# EAGLE design wifi_r3-esp_wr02 (EAGLE 7.4.0)
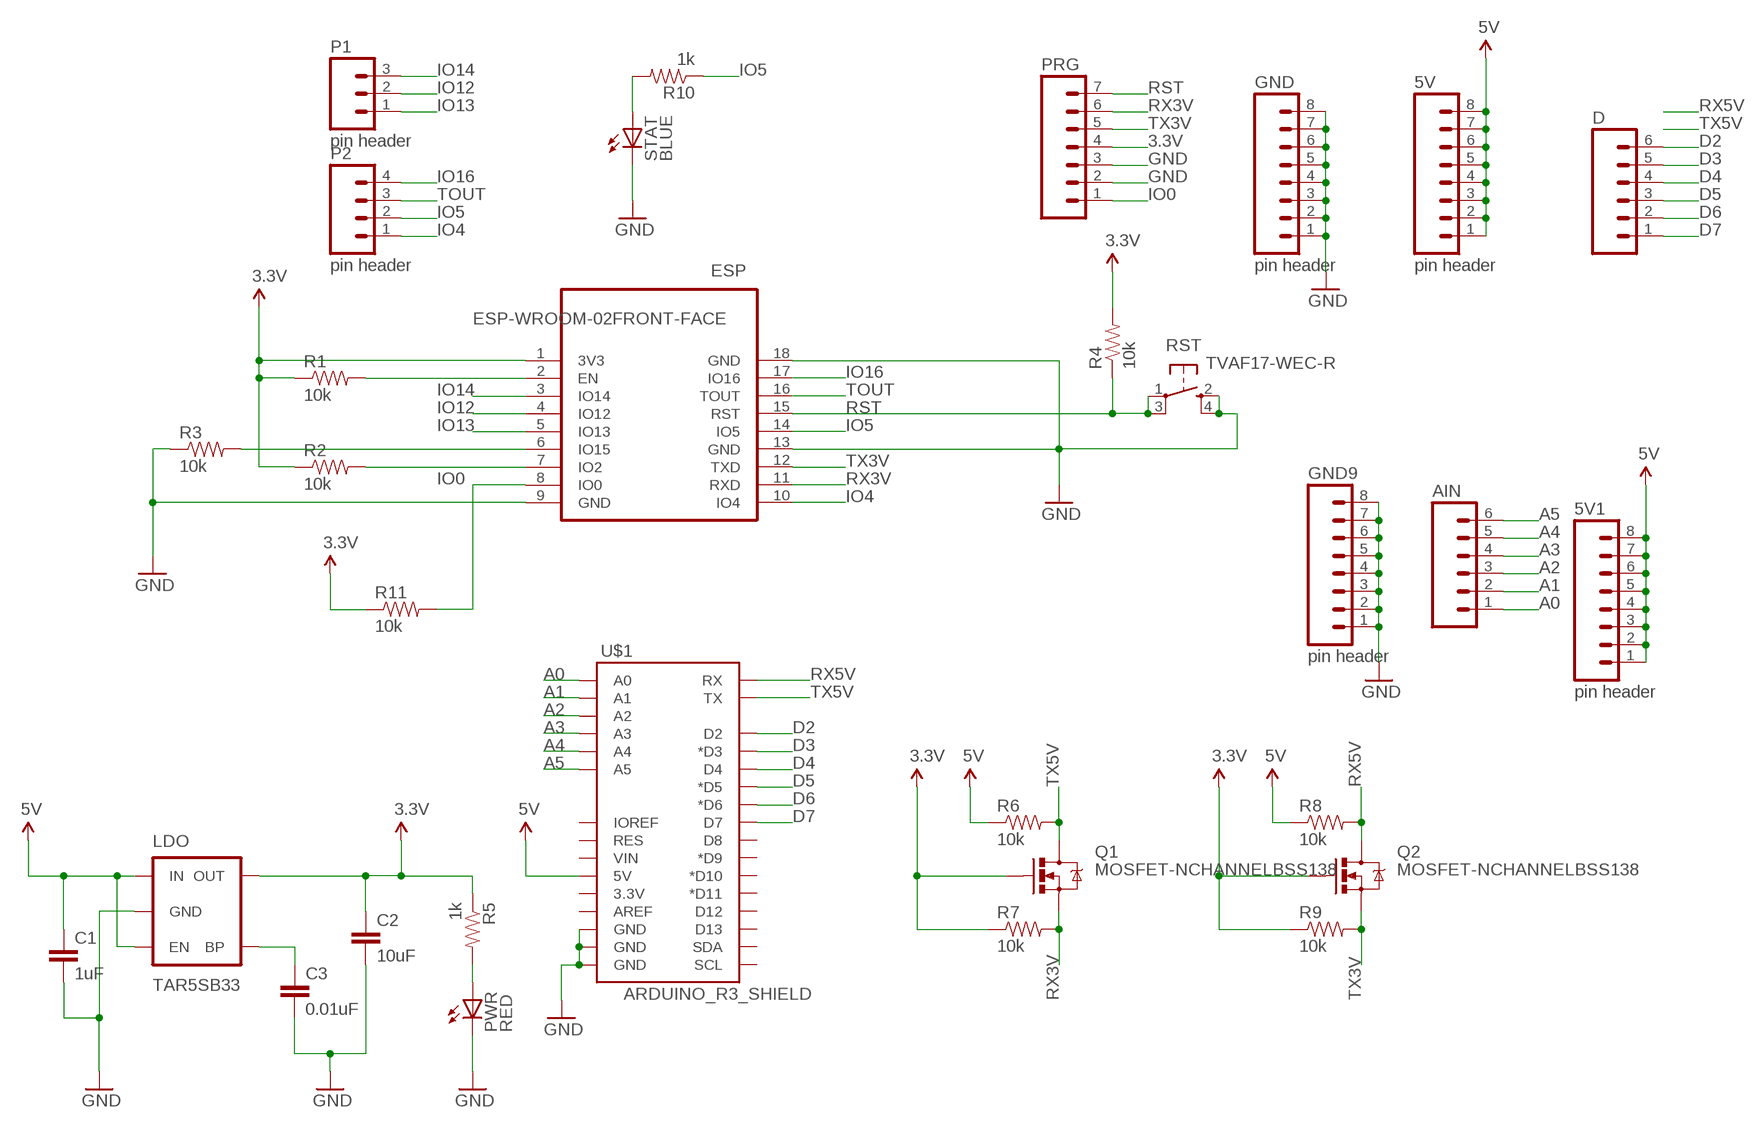
[diagram p0: schematic, sheet 1]

## Parts
5V  pin header  M081X08  [1X08]
5V1  pin header  M081X08  [1X08]
AIN  M06SIP  [1X06]
C1  1uF  CAP0603-CAP  [0603-CAP]
C2  10uF  CAP0805  [0805]
C3  0.01uF  CAP0603-CAP  [0603-CAP]
D  M06SIP  [1X06]
ESP  ESP-WROOM-02FRONT-FACE  [FRONT-FACE]
GND  pin header  M081X08  [1X08]
GND9  pin header  M081X08  [1X08]
LDO  TAR5SB33  [SOT23-5]
P1  pin header  M03PTH  [1X03]
P2  pin header  M04PTH  [1X04]
PRG  M07  [1X07]
PWR  RED  LED0603  [LED-0603]
Q1  MOSFET-NCHANNELBSS138  [SOT23]
Q2  MOSFET-NCHANNELBSS138  [SOT23]
R1  10k  RESISTOR0603  [0603-RES]
R2  10k  RESISTOR0603  [0603-RES]
R3  10k  RESISTOR0603  [0603-RES]
R4  10k  RESISTOR0603  [0603-RES]
R5  1k  RESISTOR0603  [0603-RES]
R6  10k  RESISTOR0603  [0603-RES]
R7  10k  RESISTOR0603  [0603-RES]
R8  10k  RESISTOR0603  [0603-RES]
R9  10k  RESISTOR0603  [0603-RES]
R10  1k  RESISTOR0603  [0603-RES]
R11  10k  RESISTOR0603  [0603-RES]
RST  TVAF17-WEC-R  SPST_TACT-KMR2  [KMR2]
STAT  BLUE  LED0603  [LED-0603]
U$1  ARDUINO_R3_SHIELD  [UNO_R3_SHIELD]

## Nets
3.3V: C2.1 ESP.1(3V3) LDO.5(OUT) PRG.4 Q1.1(G) Q2.1(G) R1.1 R2.1 R4.2 R5.1 R7.1 R9.1 R11.1
5V: 5V1.1 5V1.2 5V1.3 5V1.4 5V1.5 5V1.6 5V1.7 5V1.8 5V.1 5V.2 5V.3 5V.4 5V.5 5V.6 5V.7 5V.8 C1.1 LDO.1(IN) LDO.3(EN) R6.1 R8.1 U$1.5V
A0: AIN.1 U$1.A0
A1: AIN.2 U$1.A1
A2: AIN.3 U$1.A2
A3: AIN.4 U$1.A3
A4: AIN.5 U$1.A4
A5: AIN.6 U$1.A5
D2: D.6 U$1.D2
D3: D.5 U$1.D3(*D3)
D4: D.4 U$1.D4
D5: D.3 U$1.D5(*D5)
D6: D.2 U$1.D6(*D6)
D7: D.1 U$1.D7
GND: C1.2 C2.2 C3.2 ESP.9(GND) ESP.13(GND) ESP.18(GND) GND9.1 GND9.2 GND9.3 GND9.4 GND9.5 GND9.6 GND9.7 GND9.8 GND.1 GND.2 GND.3 GND.4 GND.5 GND.6 GND.7 GND.8 LDO.2(GND) PRG.2 PRG.3 PWR.C R3.1 RST.2(S) RST.4(S) STAT.C U$1.GND@0(GND) U$1.GND@1(GND) U$1.GND@2(GND)
IO0: ESP.8(IO0) PRG.1 R11.2
IO4: ESP.10(IO4) P2.1
IO5: ESP.14(IO5) P2.2 R10.1
IO12: ESP.4(IO12) P1.2
IO13: ESP.5(IO13) P1.1
IO14: ESP.3(IO14) P1.3
IO16: ESP.17(IO16) P2.4
N$3: ESP.2(EN) R1.2
N$4: ESP.7(IO2) R2.2
N$5: ESP.6(IO15) R3.2
N$118: PWR.A R5.2
N$119: R10.2 STAT.A
N$121: C3.1 LDO.4(BP)
RST: ESP.15(RST) PRG.7 R4.1 RST.1(P) RST.3(P)
RX3V: ESP.11(RXD) PRG.6 Q1.2(S) R7.2
RX5V: Q2.3(D) R8.2 U$1.RX
TOUT: ESP.16(TOUT) P2.3
TX3V: ESP.12(TXD) PRG.5 Q2.2(S) R9.2
TX5V: Q1.3(D) R6.2 U$1.TX
Unconnected: U$1.3.3V U$1.AREF U$1.D8 U$1.D9(*D9) U$1.D10(*D10) U$1.D11(*D11) U$1.D12 U$1.D13 U$1.IOREF U$1.RES U$1.SCL U$1.SDA U$1.VIN

## Library data of the parts
5V 5V1 GND GND9 = SparkFun-Connectors:M08: Header 8 Standard 8-pin 0.1" header. Use with straight break away headers (SKU : PRT-00116), right angle break away headers (PRT-00553), swiss pins (PRT-00743), machine pins (PRT-00117), and female headers (PRT-00115).
AIN D = SparkFun-Connectors:M06: Header 6 Standard 6-pin 0.1" header. Use with straight break away headers (SKU : PRT-00116), right angle break away headers (PRT-00553), swiss pins (PRT-00743), machine pins (PRT-00117), and female headers (PRT-00115). Molex polarized connector foot print use with SKU : PRT-08094 with associated crimp pins and housings. NOTES ON THE VARIANTS LOCK and LOCK_LONGPADS... This footprint was designed to help hold the alignment of a through-hole component (i.e. 6-pin header) while soldering it into place. You may notice that each hole has been shifted either up or down by 0.005 of an inch from it's more standard position (which is a perfectly straight line). This slight alteration caused the pins (the squares in the middle) to touch the edges of the holes. Because they are alternating, it causes a "brace" to hold the component in place. 0.005 has proven to be the perfect amount of "off-center" position when using our standard breakaway headers. Although looks a little odd when you look at the bare footprint, once you have a header in there, the alteration is very hard to notice. Also,if you push a header all the way into place, it is covered up entirely on the bottom side. This idea of altering the position of holes to aid alignment will be further integrated into the Sparkfun Library for other footprints. It can help hold any component with 3 or more connection pins.
C1-C3 = SparkFun-Capacitors:CAP: Capacitor Standard 0603 ceramic capacitor, and 0.1" leaded capacitor.
ESP = esp-wroom-02:ESP-WROOM-02: WiFi module - ESP-WROOM-02
LDO = y_PowerIC:TAR5SB: TAR5SB LDO Regulator TAR5SB15 - TAR5SB50 Vin 15V Iout 200mA ceramic condensor usable PIN FUNCTION 1. VIN 2. GND 3. CONTROL (Active High) 4. NOISE BYPASS 5. VOUT; PROD_ID: VREG-00822
P1 = SparkFun-Connectors:M03: Header 3 Standard 3-pin 0.1" header. Use with straight break away headers (SKU : PRT-00116), right angle break away headers (PRT-00553), swiss pins (PRT-00743), machine pins (PRT-00117), and female headers (PRT-00115). Molex polarized connector foot print use with SKU : PRT-08232 with associated crimp pins and housings.
P2 = SparkFun-Connectors:M04: Header 4 Standard 4-pin 0.1" header. Use with straight break away headers (SKU : PRT-00116), right angle break away headers (PRT-00553), swiss pins (PRT-00743), machine pins (PRT-00117), and female headers (PRT-00115). Molex polarized connector foot print use with SKU : PRT-08231 with associated crimp pins and housings. 1MM SMD Version SKU: PRT-10208
PRG = SparkFun-Connectors:M07: Header 7 Standard 7-pin 0.1" header. Use with straight break away headers (SKU : PRT-00116), right angle break away headers (PRT-00553), swiss pins (PRT-00743), machine pins (PRT-00117), and female headers (PRT-00115). NOTES ON THE VARIANTS LOCK and LOCK_LONGPADS... This footprint was designed to help hold the alignment of a through-hole component (i.e. 7-pin header) while soldering it into place. You may notice that each hole has been shifted either up or down by 0.005 of an inch from it's more standard position (which is usually a perfectly straight line). This slight alteration caused the pins (the squares in the middle) to touch the edges of the holes. Because they are alternating, it causes a "brace" to hold the header in place. 0.005 has proven to be the perfect amount of "off-center" position when using our standard breakaway headers. Although looks a little odd when you look at the bare footprint, once you have a header in there, the alteration is very hard to notice. Also, if you push a header all the way into place, it is covered up entirely on the bottom side. This idea of altering the position of holes to aid alignment will be further integrated into the Sparkfun Library for other footprints. It can help hold any component with 3 or more connection pins.
PWR STAT = SparkFun-LED:LED: LEDs Standard schematic elements and footprints for 5mm, 3mm, 1206, and 0603 sized LEDs. 5mm - Spark Fun Electronics SKU : COM-00529 (and others)
Q1 Q2 = SparkFun-DiscreteSemi:MOSFET-NCHANNEL: Common NMOSFET Parts MFG P/N Store ID Prod ID FDD8780 TRANS-09984 SI7820DN TRANS-11055 FDS6630A IC-08089 2N7002PW TRANS-11151 FQP30N06L COM-10213 TRANS-10060 BSS123LT1G TRANS-08345 BSS138 TRANS-00830 BS170 2N7000; PROD_ID: TRANS-00830
R1-R11 = SparkFun-Resistors:RESISTOR: Resistor Basic schematic elements and footprints for 0603, 1206, and PTH resistors.
RST = y_switch:SPST_TACT: SMT 6mm switch, EVQQ2 series http://www.ladyada.net/library/eagle
U$1 = SparkFun-Boards:ARDUINO_R3_SHIELD: Shield form compatible with the Arduino Uno R3.

## Net classes
0 default: width 0.406 mm

## Board
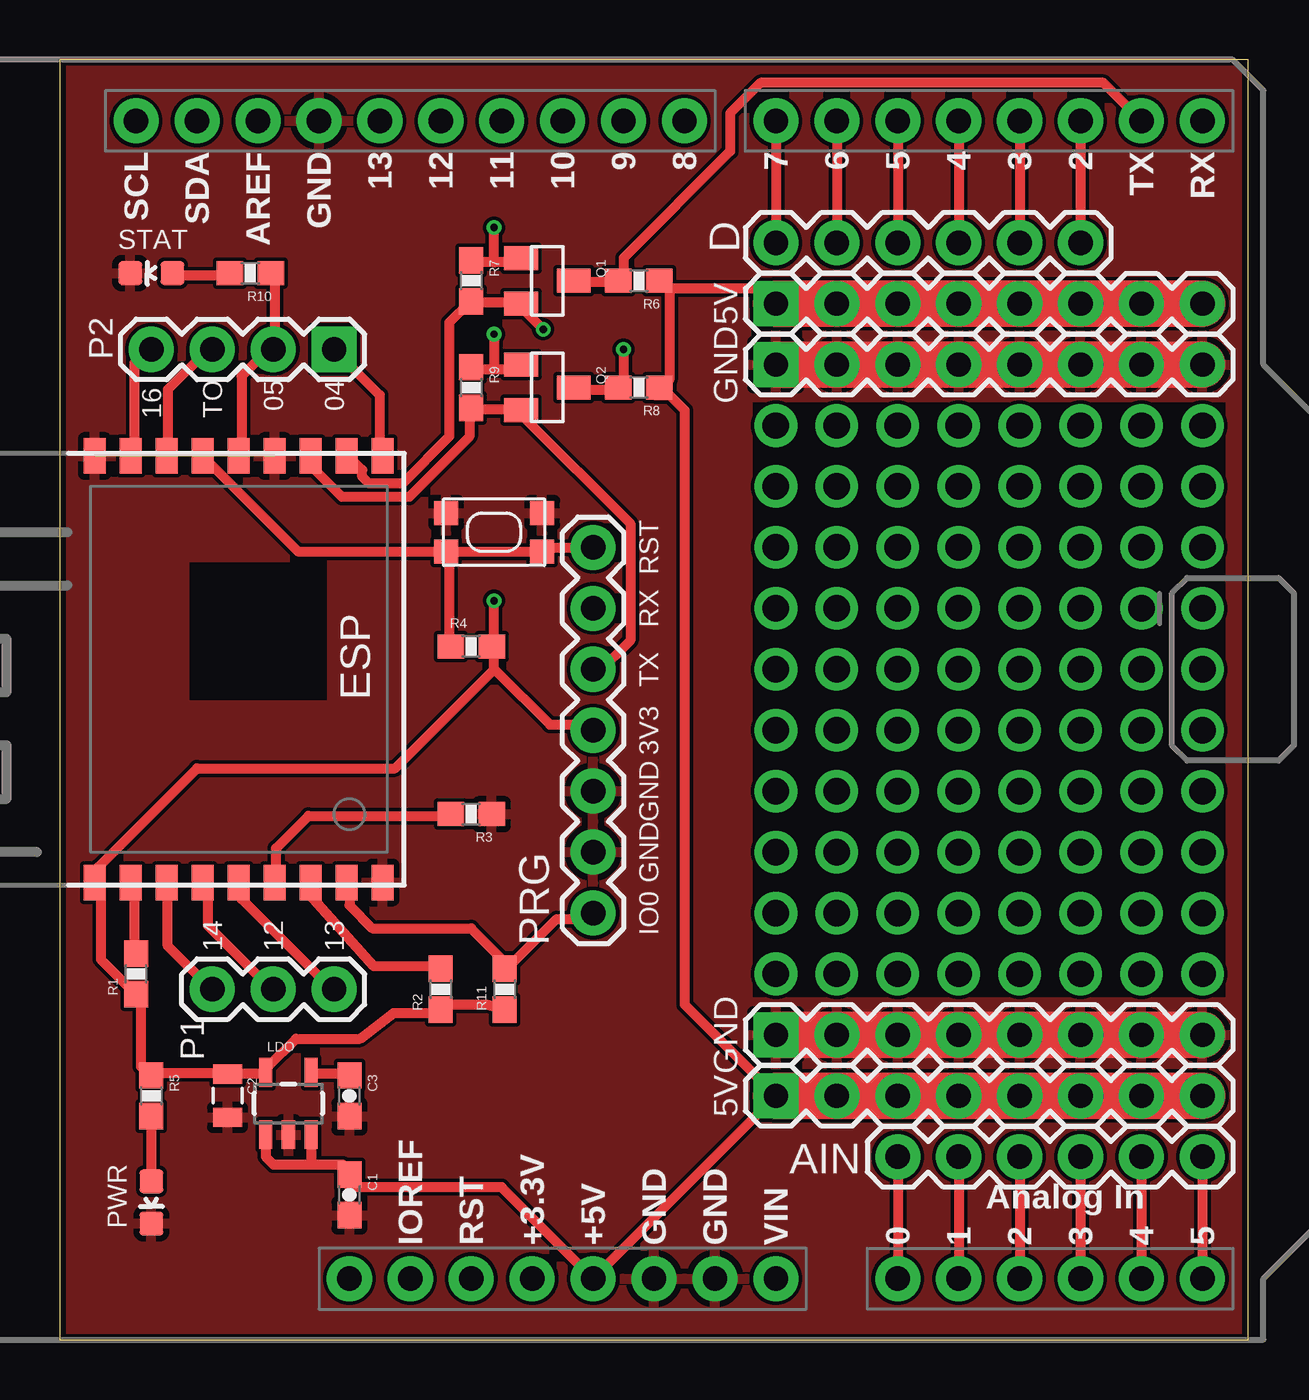
[diagram p1: board, top side]
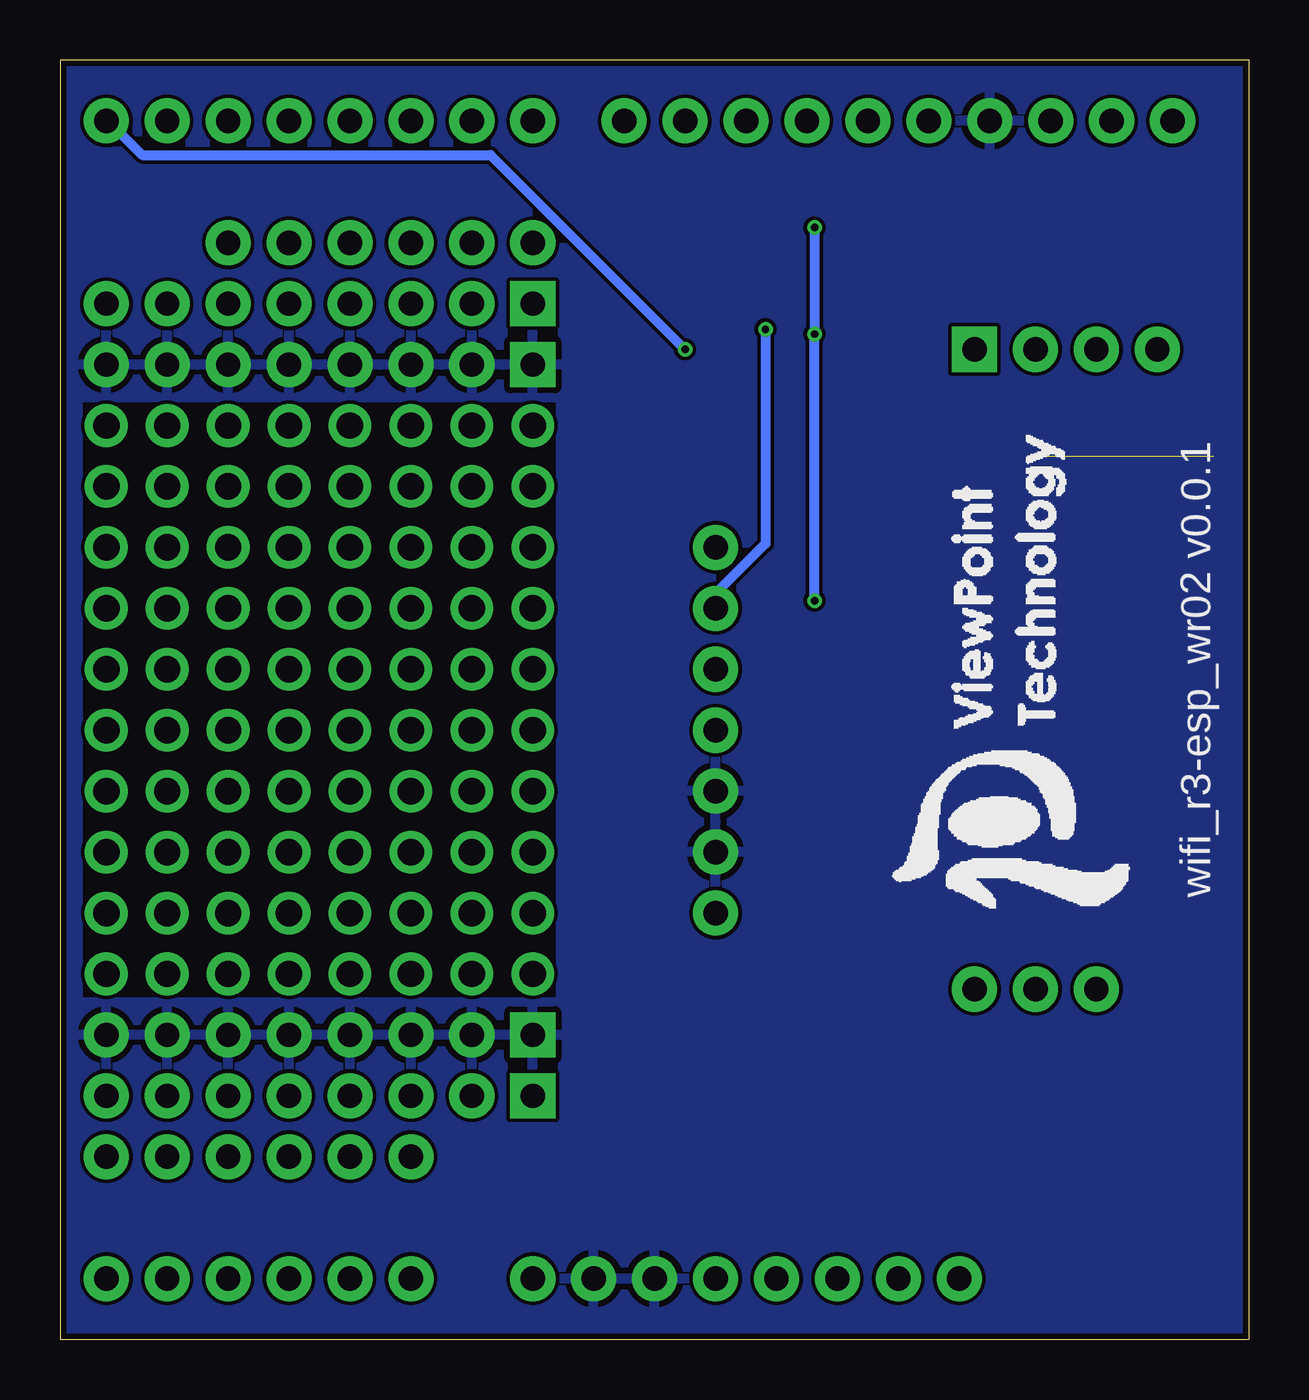
[diagram p2: board, bottom side, seen from below]

Size 49.53 x 53.34 mm. Coordinates in mm from the lower left corner, seen from the top.
Outline: 0,53.34 0,0 49.53,0 49.53,53.34 0,53.34
Copper layers (1*16): Top 0.035mm / dielectric 1.5mm / Bottom 0.035mm
Design rules "SeeedStudio_2layer_DRU_no_angle_20140221a": minimum track width 6mil, minimum drill 12mil, track to track 6mil, track to pad 6mil, pad to pad 6mil, via to via 6mil, smd to smd 0mil, copper to edge 10mil, drill to drill 10mil, minimum pad ring 10mil, minimum via ring 6mil, stop-mask expansion 2mil, vias tented up to drill 25mil, thermal gap 10mil
tRestrict: area 28.9,14.3 to 48.6,39.1
bRestrict: area 28.9,14.3 to 48.6,39.1

### Footprints (pad centres in the part's own frame; a part is rotated, then mirrored left to right if it is on the bottom)
1X08 = drill 1.016 pad 1.88 square: 1 0,0 | drill 1.016 pad 1.88: 2 2.54,0; 3 5.08,0; 4 7.62,0; 5 10.16,0; 6 12.7,0; 7 15.24,0; 8 17.78,0
1X06 = drill 1.016 pad 1.88: 1 0,0; 2 2.54,0; 3 5.08,0; 4 7.62,0; 5 10.16,0; 6 12.7,0
0603-CAP = smd 1.1 x 1: 1 -0.85,0; 2 0.85,0
0805 = smd 0.8 x 1.2: 1 -0.9,0; 2 0.9,0
FRONT-FACE = smd 1.485 x 0.9: 1 -8.893,4.9; 2 -8.893,3.4; 3 -8.893,1.9; 4 -8.893,0.4; 5 -8.893,-1.1; 6 -8.893,-2.6; 7 -8.893,-4.1; 8 -8.893,-5.6; 9 -8.893,-7.1; 10 8.893,-7.1; 11 8.893,-5.6; 12 8.893,-4.1; 13 8.893,-2.6; 14 8.893,-1.1; 15 8.893,0.4; 16 8.893,1.9; 17 8.893,3.4; 18 8.893,4.9
SOT23-5 = smd 0.55 x 1.2: 1 -0.95,-1.3; 2 0,-1.3; 3 0.95,-1.3; 4 0.95,1.3; 5 -0.95,1.3
1X03 = drill 1.016 pad 1.88: 1 0,0; 2 2.54,0; 3 5.08,0
1X04 = drill 1.016 pad 1.88 square: 1 0,0 | drill 1.016 pad 1.88: 2 2.54,0; 3 5.08,0; 4 7.62,0
1X07 = drill 1.016 pad 1.88: 1 0,0; 2 2.54,0; 3 5.08,0; 4 7.62,0; 5 10.16,0; 6 12.7,0; 7 15.24,0
LED-0603 = smd 1 x 1: A 0,-0.877; C 0,0.877
SOT23 = smd 1 x 1.4: 1 -0.95,-1.1; 2 0.95,-1.1; 3 0,1.1
0603-RES = smd 1.1 x 1: 1 -0.85,0; 2 0.85,0
KMR2 = smd 1 x 1: 1 2,0.8; 2 2,-0.8; 3 -2,0.8; 4 -2,-0.8
UNO_R3_SHIELD = drill 1.016 pad 1.88: 3.3V 50.8,26.67; 5V 50.8,29.21; A0 50.8,41.91; A1 50.8,44.45; A2 50.8,46.99; A3 50.8,49.53; A4 50.8,52.07; A5 50.8,54.61; AREF 2.54,15.24; D2 2.54,49.53; D3 2.54,46.99; D4 2.54,44.45; D5 2.54,41.91; D6 2.54,39.37; D7 2.54,36.83; D8 2.54,33.02; D9 2.54,30.48; D10 2.54,27.94; D11 2.54,25.4; D12 2.54,22.86; D13 2.54,20.32; GND@0 50.8,31.75; GND@1 50.8,34.29; GND@2 2.54,17.78; IOREF 50.8,21.59; NC 50.8,19.05; RES 50.8,24.13; RX 2.54,54.61; SCL 2.54,10.16; SDA 2.54,12.7; TX 2.54,52.07; VIN 50.8,36.83

### Placement (x,y rotation side)
5V  29.84,10.16 0 top
5V1  29.84,43.18 0 top
AIN  34.93,7.62 0 top
C1  12.07,6.03 270 top
C2  6.98,10.16 270 top
C3  12.07,10.16 270 top
D  29.84,45.72 0 top
ESP  6.35,27.94 90 top
GND  29.84,40.64 0 top
GND9  29.84,12.7 0 top
LDO  9.52,9.84 0 top
P1  11.43,14.61 180 top
P2  11.43,41.28 180 top
PRG  22.23,17.78 90 top
PWR  3.81,5.72 180 top
Q1  20.32,44.13 270 top
Q2  20.32,39.69 270 top
R1  3.18,15.24 90 top
R2  15.88,14.61 90 top
R3  17.15,21.91 180 top
R4  17.15,28.89 0 top
R5  3.81,10.16 270 top
R6  24.13,44.13 180 top
R7  17.15,44.13 270 top
R8  24.13,39.69 180 top
R9  17.15,39.69 270 top
R10  7.94,44.45 180 top
R11  18.54,14.61 90 top
RST  18.1,33.66 180 top
STAT  3.81,44.45 90 top
U$1  -6.98,53.34 270 top
U$2  [VIEWPOINT_M]  4.67,17.63 90 bottom

### Tracks (layer width: path | path; a pad name or v marks a point on that pad's centre or on a via)
3.3V  (via drill 0.3)
  Top 0.406: 18.1,40.44 19.02,40.44 Q2.1 | 18.1,40.44 17.35,40.44 R9.1 | 18.1,44.91 19.02,44.91 Q1.1 | 18.1,44.91 17.35,44.91 R7.1 | v18.1,41.91 18.1,40.44 | 18.1,44.91 v18.1,46.36 | R11.1 17.78,13.97 15.88,13.97 R2.1 15.67,13.61 13.91,13.61 12.51,12.54 9.84,12.54 8.69,11.38 LDO.5 8.41,11.1 7.01,11.1 C2.1 6.73,11.1 3.94,11.1 R5.1 3.66,11.1 3.38,11.38 3.38,14.17 R1.1 3.1,14.45 1.7,15.85 1.7,18.92 ESP.1 1.59,19.05 1.59,19.68 5.72,23.81 13.97,23.81 18.1,27.94 | 18.1,27.94 18.1,28.89 | 18.1,28.89 v18.1,30.8 | 18.1,28.89 R4.2 | PRG.4 22.1,25.63 20.42,25.63 18.19,27.86 18.1,27.94
  Bottom 0.406: v18.1,46.36 v18.1,41.91 v18.1,30.8
5V
  Top 0.406: LDO.1 8.58,7.62 8.89,7.3 10.48,7.3 | 10.48,7.3 11.8,7.3 C1.1 12.07,6.35 18.41,6.35 U$1.5V 5V.1 26.04,13.97 26.04,38.73 25.4,39.37 24.77,39.37 R8.1 25.4,40.01 25.4,43.82 | LDO.3 10.48,7.31 10.48,7.3 | 25.4,43.82 29.21,43.82 5V1.1 | 25.4,43.82 R6.1
  Top 1.93: 5V.1 5V.2 5V.3 5V.4 5V.5 5V.6 5V.7 5V.8 | 5V1.1 5V1.2 5V1.3 5V1.4 5V1.5 5V1.6 5V1.7 5V1.8
A0
  Top 0.406: AIN.1 U$1.A0
A1
  Top 0.406: AIN.2 U$1.A1
A2
  Top 0.406: AIN.3 U$1.A2
A3
  Top 0.406: AIN.4 U$1.A3
A4
  Top 0.406: AIN.5 U$1.A4
A5
  Top 0.406: AIN.6 U$1.A5
D2
  Top 0.406: U$1.D2 D.6
D3
  Top 0.406: U$1.D3 D.5
D4
  Top 0.406: U$1.D4 D.4
D5
  Top 0.406: U$1.D5 D.3
D6
  Top 0.406: U$1.D6 D.2
D7
  Top 0.406: U$1.D7 D.1
GND  (1 unrouted)
  Top 0.406: ESP.13 8.97,36.8 8.97,36.85 | 22.28,20.88 22.38,20.88 PRG.2
  Top 1.93: GND.1 GND.8 | GND9.1 GND9.8
  pour Top: -6.98,53.34 -6.98,0 52.71,0 52.71,53.34
  pour Bottom: -6.98,53.34 -6.98,0 52.71,0 52.71,53.34
IO0
  Top 0.406: ESP.8 12.07,18.93 12.07,18.1 13.02,17.14 17.15,17.14 18.54,15.75 R11.2 18.75,15.57 20.7,17.53 22.1,17.53 PRG.1
IO4
  Top 0.406: P2.1 13.34,39.37 13.34,37.47 ESP.10
IO5
  Top 0.406: R10.1 8.97,44.35 8.97,41.28 P2.2 8.69,41.28 7.57,40.16 7.57,37.08 ESP.14
IO12
  Top 0.406: ESP.4 6.17,18.92 6.17,17.25 8.69,14.73 P1.2
IO13
  Top 0.406: ESP.5 7.57,18.92 7.57,18.36 11.2,14.73 P1.1
IO14
  Top 0.406: ESP.3 4.5,18.92 4.5,16.41 6.17,14.73 P1.3
IO16
  Top 0.406: ESP.17 3.1,37.08 3.1,40.72 3.66,41.28 P2.4
N$1  (via drill 1.1 pad 1.78)
  other vias: 32.38,25.4
N$2  (via drill 1.1 pad 1.78)
  other vias: 29.84,25.4
N$3
  Top 0.406: R1.2 3.1,16.13 3.1,18.92 ESP.2
N$4
  Top 0.406: R2.2 15.67,15.57 13.08,15.57 10.36,18.61 ESP.7
N$5
  Top 0.406: R3.2 16.23,21.83 10.36,21.83 9,20.47 ESP.6
N$6  (via drill 1.1 pad 1.78)
  other vias: 29.84,27.94
N$8  (via drill 1.1 pad 1.78)
  other vias: 29.84,30.48
N$9  (via drill 1.1 pad 1.78)
  other vias: 29.84,33.02
N$11  (via drill 1.1 pad 1.78)
  other vias: 29.84,35.56
N$12  (via drill 1.1 pad 1.78)
  other vias: 29.84,38.1
N$14  (via drill 1.1 pad 1.78)
  other vias: 32.38,27.94
N$15  (via drill 1.1 pad 1.78)
  other vias: 32.38,30.48
N$16  (via drill 1.1 pad 1.78)
  other vias: 32.38,33.02
N$17  (via drill 1.1 pad 1.78)
  other vias: 32.38,35.56
N$18  (via drill 1.1 pad 1.78)
  other vias: 32.38,38.1
N$20  (via drill 1.1 pad 1.78)
  other vias: 34.93,25.4
N$21  (via drill 1.1 pad 1.78)
  other vias: 34.93,27.94
N$22  (via drill 1.1 pad 1.78)
  other vias: 34.93,30.48
N$23  (via drill 1.1 pad 1.78)
  other vias: 34.93,33.02
N$24  (via drill 1.1 pad 1.78)
  other vias: 34.93,35.56
N$25  (via drill 1.1 pad 1.78)
  other vias: 34.93,38.1
N$27  (via drill 1.1 pad 1.78)
  other vias: 37.46,25.4
N$28  (via drill 1.1 pad 1.78)
  other vias: 37.46,27.94
N$29  (via drill 1.1 pad 1.78)
  other vias: 37.46,30.48
N$30  (via drill 1.1 pad 1.78)
  other vias: 37.46,33.02
N$31  (via drill 1.1 pad 1.78)
  other vias: 37.46,35.56
N$32  (via drill 1.1 pad 1.78)
  other vias: 37.46,38.1
N$34  (via drill 1.1 pad 1.78)
  other vias: 40.01,25.4
N$35  (via drill 1.1 pad 1.78)
  other vias: 40.01,27.94
N$36  (via drill 1.1 pad 1.78)
  other vias: 40.01,30.48
N$37  (via drill 1.1 pad 1.78)
  other vias: 40.01,33.02
N$38  (via drill 1.1 pad 1.78)
  other vias: 40.01,35.56
N$39  (via drill 1.1 pad 1.78)
  other vias: 40.01,38.1
N$41  (via drill 1.1 pad 1.78)
  other vias: 42.55,25.4
N$42  (via drill 1.1 pad 1.78)
  other vias: 42.55,27.94
N$43  (via drill 1.1 pad 1.78)
  other vias: 42.55,30.48
N$44  (via drill 1.1 pad 1.78)
  other vias: 42.55,33.02
N$45  (via drill 1.1 pad 1.78)
  other vias: 42.55,35.56
N$46  (via drill 1.1 pad 1.78)
  other vias: 42.55,38.1
N$48  (via drill 1.1 pad 1.78)
  other vias: 45.09,25.4
N$49  (via drill 1.1 pad 1.78)
  other vias: 45.09,27.94
N$50  (via drill 1.1 pad 1.78)
  other vias: 45.09,30.48
N$51  (via drill 1.1 pad 1.78)
  other vias: 45.09,33.02
N$52  (via drill 1.1 pad 1.78)
  other vias: 45.09,35.56
N$53  (via drill 1.1 pad 1.78)
  other vias: 45.09,38.1
N$55  (via drill 1.1 pad 1.78)
  other vias: 47.63,25.4
N$56  (via drill 1.1 pad 1.78)
  other vias: 47.63,27.94
N$57  (via drill 1.1 pad 1.78)
  other vias: 47.63,30.48
N$58  (via drill 1.1 pad 1.78)
  other vias: 47.63,33.02
N$59  (via drill 1.1 pad 1.78)
  other vias: 47.63,35.56
N$60  (via drill 1.1 pad 1.78)
  other vias: 47.63,38.1
N$65  (via drill 1.1 pad 1.78)
  other vias: 29.84,15.24
N$66  (via drill 1.1 pad 1.78)
  other vias: 29.84,17.78
N$67  (via drill 1.1 pad 1.78)
  other vias: 29.84,20.32
N$68  (via drill 1.1 pad 1.78)
  other vias: 29.84,22.86
N$72  (via drill 1.1 pad 1.78)
  other vias: 32.38,15.24
N$73  (via drill 1.1 pad 1.78)
  other vias: 32.38,17.78
N$74  (via drill 1.1 pad 1.78)
  other vias: 32.38,20.32
N$75  (via drill 1.1 pad 1.78)
  other vias: 32.38,22.86
N$79  (via drill 1.1 pad 1.78)
  other vias: 34.93,15.24
N$80  (via drill 1.1 pad 1.78)
  other vias: 34.93,17.78
N$81  (via drill 1.1 pad 1.78)
  other vias: 34.93,20.32
N$82  (via drill 1.1 pad 1.78)
  other vias: 34.93,22.86
N$86  (via drill 1.1 pad 1.78)
  other vias: 37.46,15.24
N$87  (via drill 1.1 pad 1.78)
  other vias: 37.46,17.78
N$88  (via drill 1.1 pad 1.78)
  other vias: 37.46,20.32
N$89  (via drill 1.1 pad 1.78)
  other vias: 37.46,22.86
N$93  (via drill 1.1 pad 1.78)
  other vias: 40.01,15.24
N$94  (via drill 1.1 pad 1.78)
  other vias: 40.01,17.78
N$95  (via drill 1.1 pad 1.78)
  other vias: 40.01,20.32
N$96  (via drill 1.1 pad 1.78)
  other vias: 40.01,22.86
N$100  (via drill 1.1 pad 1.78)
  other vias: 42.55,15.24
N$101  (via drill 1.1 pad 1.78)
  other vias: 42.55,17.78
N$102  (via drill 1.1 pad 1.78)
  other vias: 42.55,20.32
N$103  (via drill 1.1 pad 1.78)
  other vias: 42.55,22.86
N$107  (via drill 1.1 pad 1.78)
  other vias: 45.09,15.24
N$108  (via drill 1.1 pad 1.78)
  other vias: 45.09,17.78
N$109  (via drill 1.1 pad 1.78)
  other vias: 45.09,20.32
N$110  (via drill 1.1 pad 1.78)
  other vias: 45.09,22.86
N$114  (via drill 1.1 pad 1.78)
  other vias: 47.63,15.24
N$115  (via drill 1.1 pad 1.78)
  other vias: 47.63,17.78
N$116  (via drill 1.1 pad 1.78)
  other vias: 47.63,20.32
N$117  (via drill 1.1 pad 1.78)
  other vias: 47.63,22.86
N$118
  Top 0.406: R5.2 PWR.A
N$119
  Top 0.406: STAT.A 4.77,44.35 7.01,44.35 R10.2
N$121
  Top 0.406: C3.1 12.04,11.1 10.64,11.1 LDO.4
RST
  Top 0.406: ESP.15 9.93,32.86 RST.1 | RST.1 RST.3 20.26,33.02 PRG.7 | R4.1 16.23,28.98 16.23,32.61 RST.1
RX3V  (via drill 0.3)
  Top 0.406: ESP.11 12.04,36.8 12.6,36.25 12.6,35.97 12.88,35.69 14.27,35.69 16.23,37.64 16.23,42.39 17.07,43.23 R7.2 17.35,43.23 19.02,43.23 Q1.2 19.3,42.95 v20.14,42.11
  Bottom 0.406: v20.14,42.11 20.14,33.17 22.1,31.22 22.1,30.66 PRG.6
RX5V  (via drill 0.3)
  Top 0.406: Q2.3 21.54,39.6 23.22,39.6 R8.2 23.5,39.88 v23.5,41.28
  Bottom 0.406: v23.5,41.28 31.6,49.38 46.13,49.38 47.52,50.78 U$1.RX
TOUT
  Top 0.406: ESP.16 4.5,37.08 4.5,39.6 6.17,41.28 P2.3
TX3V
  Top 0.406: ESP.12 10.64,36.8 10.64,36.25 11.76,35.13 14.55,35.13 17.07,37.64 17.07,38.76 R9.2 17.35,38.76 19.02,38.76 Q2.2 19.3,38.48 23.77,34.01 23.77,29.15 22.38,27.75 22.38,28.14 PRG.5
TX5V
  Top 0.406: U$1.TX 43.5,52.39 29.21,52.39 27.94,51.12 27.94,49.53 23.5,45.09 23.5,44.45 R6.2 23.22,44.07 21.54,44.07 Q1.3

### Text on the board
tPlace: TO | 05 | 04 | 16 | RST | RX | TX | 3V3 | GND | GND | IO0 | 14 | 12 | 13
bPlace: wifi_r3-esp_wr02 v0.0.1
tNames: 5V | GND | GND | 5V